# EAGLE design match (EAGLE 7.2.0)
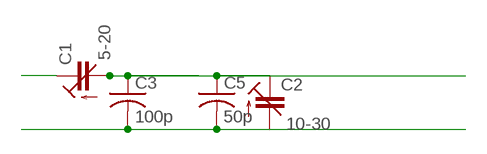
[diagram p0: schematic, sheet 1]

## Parts
C1  5-20  C-TRIMM  [SGC3S]
C2  10-30  C-TRIMM  [SGC3S]
C3  100p  C-USC0805  [C0805]
C5  50p  C-USC0805  [C0805]

## Nets
N$1: C1.P$1(A) C2.P$2(E) C3.1 C5.1
N$7: C1.P$2(E)
N$8: C3.2 C5.2
Unconnected: C2.P$1(A)

## Library data of the parts
C1 C2 = sprague:C-TRIMM: Trimm capacitor
C3 C5 = rcl:C-US: CAPACITOR, American symbol

## Board
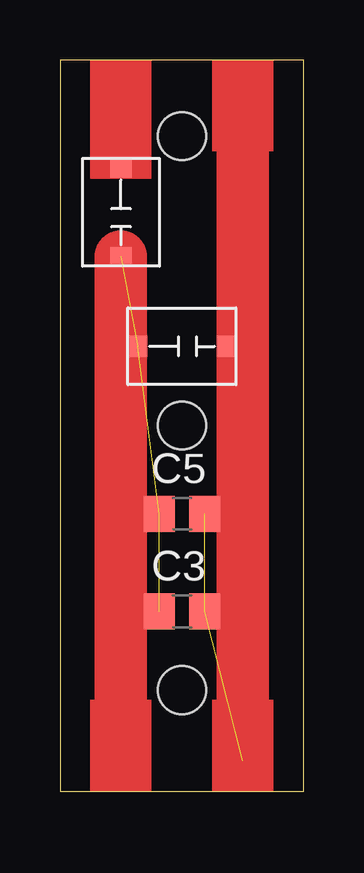
[diagram p1: board, top side]

Size 10.16 x 30.48 mm. Coordinates in mm from the lower left corner, seen from the top.
Outline: 0,0 10.16,0 10.16,30.48 0,30.48 0,0
Copper layers (1*16): Top 0.035mm / dielectric 1.5mm / Bottom 0.035mm
Design rules "default": minimum track width 10mil, minimum drill 24mil, track to track 8mil, track to pad 8mil, pad to pad 8mil, via to via 8mil, smd to smd 8mil, copper to edge 40mil, drill to drill 8mil, minimum pad ring 10mil, minimum via ring 8mil, stop-mask expansion 4mil, vias tented up to drill 0mil, thermal gap 10mil
Holes 2 mm at 5.08,15.24 5.08,27.3 5.08,4.22

### Footprints (pad centres in the part's own frame; a part is rotated, then mirrored left to right if it is on the bottom)
SGC3S = smd 0.9 x 0.8: P$1 0,1.85; P$2 0,-1.85
C0805 = smd 1.3 x 1.5: 1 -0.95,0; 2 0.95,0

### Placement (x,y rotation side)
C1  2.54,24.13 180 top
C2  5.08,18.54 270 top
C3  5.08,7.49 0 top
C5  5.08,11.56 0 top

### Tracks (layer width: path | path; a pad name or v marks a point on that pad's centre or on a via)
N$1  (3 unrouted)
  Top 2.184: C1.P$1 2.54,1.27
N$8  (2 unrouted)
  Top 2.184: 7.62,1.27 7.62,27.94
(copper drawn outside any net)
  shapes: Top area x5